# EAGLE schematic Slider (EAGLE 6.1)
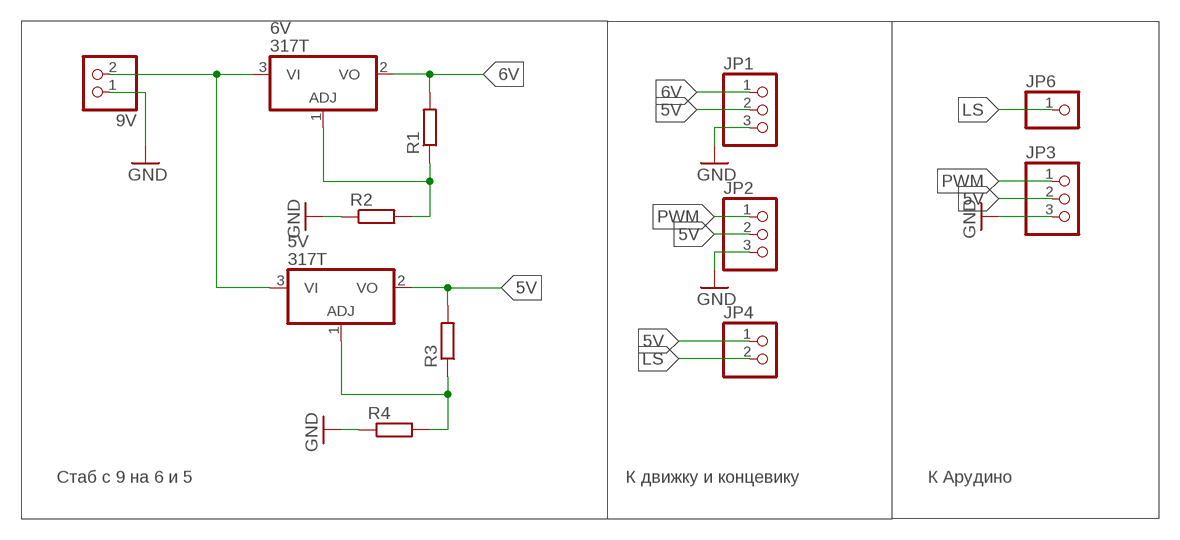
[diagram p0: schematic, sheet 1]

## Parts
5V  317T  [TO220H]
6V  317T  [TO220H]
9V  PINHD-1X2  [1X02]
JP1  PINHD-1X3  [1X03]
JP2  PINHD-1X3  [1X03]
JP3  PINHD-1X3  [1X03]
JP4  PINHD-1X2  [1X02]
JP6  PINHD-1X1  [1X01]
R1  R-EU_R0805  [R0805]
R2  R-EU_R0805  [R0805]
R3  R-EU_R0805  [R0805]
R4  R-EU_R0805  [R0805]

## Nets
5V: 5V.2(VO) JP1.2 JP2.2 JP3.2 JP4.1 R3.2
6V: 6V.2(VO) JP1.1 R1.2
GND: 9V.1 JP1.3 JP2.3 JP3.3 R2.1 R4.1
LS: JP4.2 JP6.1
N$1: 6V.1(ADJ) R1.1 R2.2
N$3: 5V.3(VI) 6V.3(VI) 9V.2
N$5: 5V.1(ADJ) R3.1 R4.2
PWM: JP2.1 JP3.1

## Notes on the sheet
- Стаб с 9 на 6 и 5 | К движку и концевику | К Арудино

## Library data of the parts
5V 6V = linear:*317: Positive VOLTAGE REGULATOR
9V JP4 = pinhead:PINHD-1X2: PIN HEADER
JP1-JP3 = pinhead:PINHD-1X3: PIN HEADER
JP6 = pinhead:PINHD-1X1: PIN HEADER
R1-R4 = resistor:R-EU_: RESISTOR, European symbol